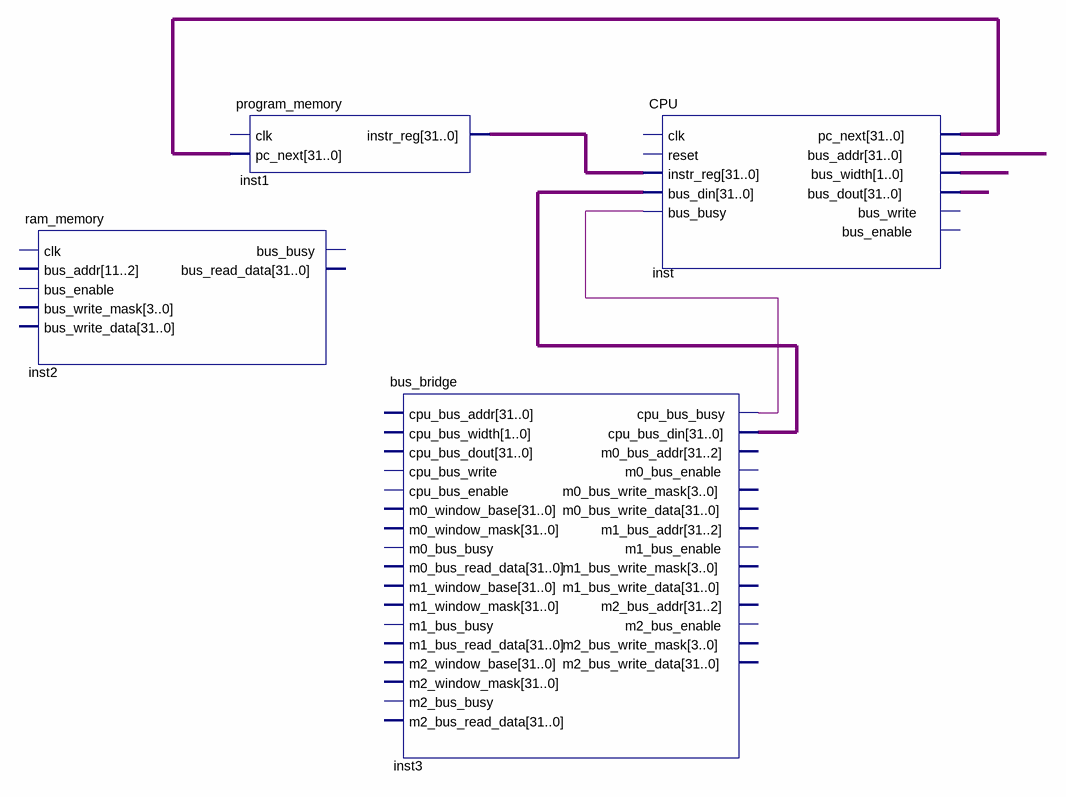
[diagram p0: schematic sheet]
// Quartus schematic Top-level.bdf as structural Verilog: 4 symbols, 0 pins
module \Top-level  (
);

  wire inst3_cpu_bus_busy;
  wire [1:0] inst_bus_width;
  wire [31:0] inst1_instr_reg, inst3_cpu_bus_din, inst_bus_addr, inst_bus_dout, inst_pc_next;

  ram_memory inst2 ();  // open: clk, bus_addr, bus_enable, bus_write_mask, bus_write_data, bus_busy, bus_read_data
  program_memory inst1 (.pc_next(inst_pc_next), .instr_reg(inst1_instr_reg));  // open: clk
  bus_bridge inst3 (
    .cpu_bus_busy(inst3_cpu_bus_busy), .cpu_bus_din(inst3_cpu_bus_din));  // open: cpu_bus_addr, cpu_bus_width, cpu_bus_dout, cpu_bus_write, cpu_bus_enable, m0_window_base, m0_window_mask, m0_bus_busy, m0_bus_read_data, m1_window_base, m1_window_mask, m1_bus_busy, m1_bus_read_data, m2_window_base, m2_window_mask, m2_bus_busy, m2_bus_read_data, m0_bus_addr, m0_bus_enable, m0_bus_write_mask, m0_bus_write_data, m1_bus_addr, m1_bus_enable, m1_bus_write_mask, m1_bus_write_data, m2_bus_addr, m2_bus_enable, m2_bus_write_mask, m2_bus_write_data
  CPU inst (
    .instr_reg(inst1_instr_reg), .bus_din(inst3_cpu_bus_din), .bus_busy(inst3_cpu_bus_busy),
    .pc_next(inst_pc_next), .bus_addr(inst_bus_addr), .bus_width(inst_bus_width), .bus_dout(inst_bus_dout));  // open: clk, reset, bus_write, bus_enable
endmodule
